# Altium schematic sheet infra&stlink.SchDoc
size Tabloid
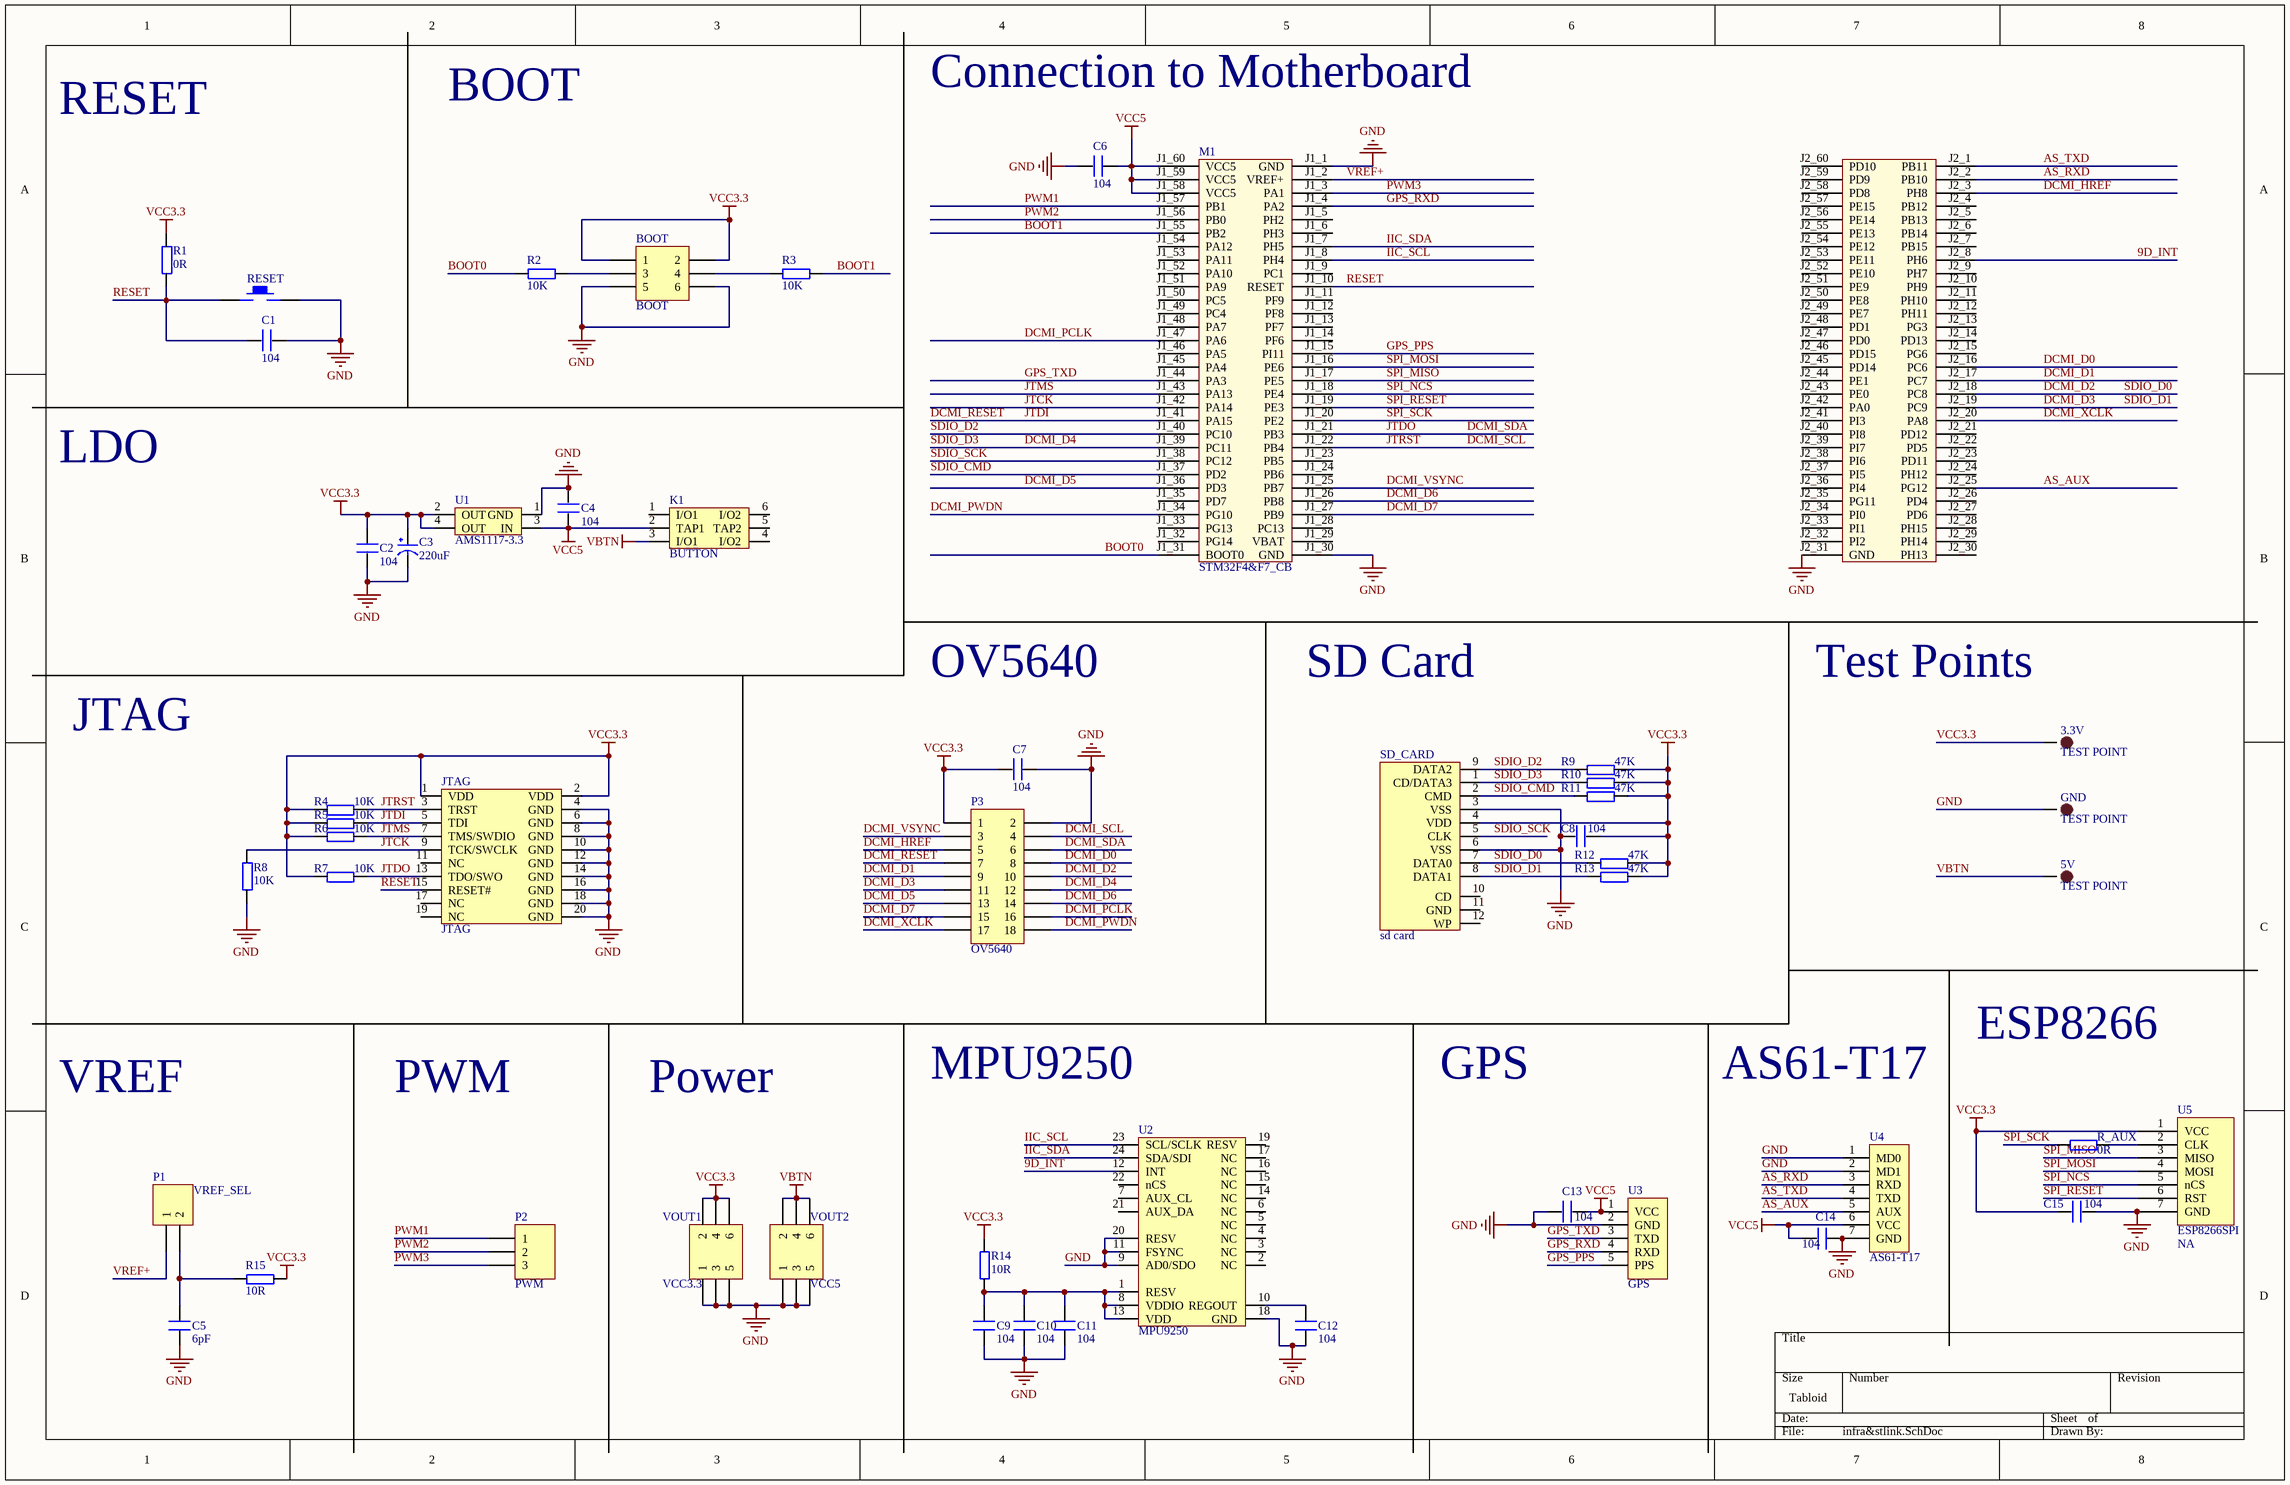
[diagram p0: infra&stlink.SchDoc]

## Parts
3.3V  TEST POINT  [TP-1.5]
5V  TEST POINT  [TP-1.5]
BOOT  BOOT  [HDR2X3]
C1  104  [0805]
C2  104  [0805]
C3  220uF  [CC6.56.5]
C4  104  [0805]
C5  6pF  [0805]
C6  104  [0805]
C7  104  [0805]
C8  104  [0805]
C9  104  [0805]
C10  104  [0805]
C11  104  [0805]
C12  104  [0805]
C13  104  [0805]
C14  104  [0805]
C15  104  [0805]
GND  TEST POINT  [TP-1.5]
JTAG  JTAG  [JTAG_20]
K1  BUTTON  [BTN8.5*8.5]
M1  STM32F4&F7_CB  [STM32F4&F7_CB]
P1  VREF_SEL  [HDR1X2]
P2  PWM  [HDR1X3]
P3  OV5640  [HDR2X9]
R1  0R  [0805]
R2  10K  [0805]
R3  10K  [0805]
R4  10K  [0805]
R5  10K  [0805]
R6  10K  [0805]
R7  10K  [0805]
R8  10K  [0805]
R9  47K  [0805]
R10  47K  [0805]
R11  47K  [0805]
R12  47K  [0805]
R13  47K  [0805]
R14  10R  [0805]
R15  10R  [0805]
R_AUX  0R  [0805]
RESET  KEY_M  [KEY_M]  (value not drawn)
SD_CARD  sd card  [SDCARD_L]
U1  AMS1117-3.3  [AMS1117]
U2  MPU9250  [QFN24-t]
U3  GPS  [HDR1X5]
U4  AS61-T17  [HDR1X7]
U5  NA  [Edge Connector7]
VOUT1  VCC3.3  [HDR2X3]
VOUT2  VCC5  [HDR2X3]

## Nets
GND: BOOT.5 BOOT.6 C1.2 C2.1 C3.2(GND) C4.2 C5.1 C6.1 C7.2 C8.1 C9.1 C10.1 C11.1 C12.1 C13.1 C14.1 C15.2 GND.1 JTAG.4(GND) JTAG.6(GND) JTAG.8(GND) JTAG.10(GND) JTAG.12(GND) JTAG.14(GND) JTAG.16(GND) JTAG.18(GND) JTAG.20(GND) M1.J1_1(GND) M1.J1_30(GND) M1.J2_31(GND) P3.2 R8.1 RESET.2 SD_CARD.3(VSS) SD_CARD.6(VSS) U1.1(GND) U2.9(AD0/SDO) U2.11(FSYNC) U2.18(GND) U2.20(RESV) U3.2(GND) U4.1(MD0) U4.2(MD1) U4.7(GND) U5.7(GND) VOUT1.1 VOUT1.3 VOUT1.5 VOUT2.1 VOUT2.3 VOUT2.5
VBTN: 5V.1 K1.3(I/O1) VOUT2.2 VOUT2.4 VOUT2.6
VCC3.3: 3.3V.1 BOOT.1 BOOT.2 C2.2 C3.1(VCC) C7.1 C8.2 C15.1 JTAG.1(VDD) JTAG.2(VDD) P3.1 R1.2 R4.1 R5.1 R6.1 R7.1 R9.2 R10.2 R11.2 R12.2 R13.2 R14.2 R15.2 SD_CARD.4(VDD) U1.2(OUT) U1.4(OUT) U5.1(VCC) VOUT1.2 VOUT1.4 VOUT1.6
VCC5: C4.1 C6.2 C13.2 C14.2 K1.2(TAP1) M1.J1_58(VCC5) M1.J1_59(VCC5) M1.J1_60(VCC5) U1.3(IN) U3.1(VCC) U4.6(VCC)
9D_INT: M1.J2_8(PH6) U2.12(INT)
AS_AUX: M1.J2_25(PG12) U4.5(AUX)
AS_RXD: M1.J2_2(PB10) U4.3(RXD)
AS_TXD: M1.J2_1(PB11) U4.4(TXD)
BOOT0: M1.J1_31(BOOT0) R2.1
BOOT1: M1.J1_55(PB2) R3.2
DCMI_D0: M1.J2_16(PC6) P3.8
DCMI_D1: M1.J2_17(PC7) P3.9
DCMI_D2: M1.J2_18(PC8) P3.10 R12.1 SD_CARD.7(DATA0)  [also labelled SDIO_D0]
DCMI_D3: M1.J2_19(PC9) P3.11 R13.1 SD_CARD.8(DATA1)  [also labelled SDIO_D1]
DCMI_D4: M1.J1_39(PC11) P3.12 R10.1 SD_CARD.1(CD/DATA3)  [also labelled SDIO_D3]
DCMI_D5: M1.J1_36(PD3) P3.13
DCMI_D6: M1.J1_26(PB8) P3.14
DCMI_D7: M1.J1_27(PB9) P3.15
DCMI_HREF: M1.J2_3(PH8) P3.5
DCMI_PCLK: M1.J1_47(PA6) P3.16
DCMI_PWDN: M1.J1_34(PG10) P3.18
DCMI_RESET: JTAG.5(TDI) M1.J1_41(PA15) P3.7 R5.2  [also labelled JTDI]
DCMI_SCL: JTAG.3(TRST) M1.J1_22(PB4) P3.4 R4.2  [also labelled JTRST]
DCMI_SDA: JTAG.13(TDO/SWO) M1.J1_21(PB3) P3.6 R7.2  [also labelled JTDO]
DCMI_VSYNC: M1.J1_25(PB7) P3.3
DCMI_XCLK: M1.J2_20(PA8) P3.17
GPS_PPS: M1.J1_15(PI11) U3.5(PPS)
GPS_RXD: M1.J1_4(PA2) U3.4(RXD)
GPS_TXD: M1.J1_44(PA3) U3.3(TXD)
IIC_SCL: M1.J1_8(PH4) U2.23(SCL/SCLK)
IIC_SDA: M1.J1_7(PH5) U2.24(SDA/SDI)
JTCK: JTAG.9(TCK/SWCLK) M1.J1_42(PA14) R8.2
JTMS: JTAG.7(TMS/SWDIO) M1.J1_43(PA13) R6.2
PWM1: M1.J1_57(PB1) P2.1
PWM2: M1.J1_56(PB0) P2.2
PWM3: M1.J1_3(PA1) P2.3
RESET: C1.1 JTAG.15(RESET#) M1.J1_10(RESET) R1.1 RESET.1
SDIO_CMD: M1.J1_37(PD2) R11.1 SD_CARD.2(CMD)
SDIO_D2: M1.J1_40(PC10) R9.1 SD_CARD.9(DATA2)
SDIO_SCK: M1.J1_38(PC12) SD_CARD.5(CLK)
SPI_MISO: M1.J1_17(PE5) U5.3(MISO)
SPI_MOSI: M1.J1_16(PE6) U5.4(MOSI)
SPI_NCS: M1.J1_18(PE4) U5.5(nCS)
SPI_RESET: M1.J1_19(PE3) U5.6(RST)
SPI_SCK: M1.J1_20(PE2) R_AUX.1
VREF+: M1.J1_2(VREF+) P1.1
NetBOOT_3: BOOT.3 R2.2
NetBOOT_4: BOOT.4 R3.1
NetC5_2: C5.2 P1.2 R15.1
NetC9_2: C9.2 C10.2 C11.2 R14.1 U2.1(RESV) U2.8(VDDIO) U2.13(VDD)
NetC12_2: C12.2 U2.10(REGOUT)
NetR_AUX_2: R_AUX.2 U5.2(CLK)

Not connected (* = marked no-connect by the designer): JTAG 11(NC) 17(NC) 19(NC); K1 1(I/O1) 4(I/O2) 5(TAP2) 6(I/O2); M1 J1_5(PH2) J1_6(PH3) J1_9(PC1) J1_11(PF9) J1_12(PF8) J1_13(PF7) J1_14(PF6) J1_23(PB5) J1_24(PB6) J1_28(PC13) J1_29(VBAT) J1_32(PG14) J1_33(PG13) J1_35(PD7) J1_45(PA4) J1_46(PA5) J1_48(PA7) J1_49(PC4) J1_50(PC5) J1_51(PA9) J1_52(PA10) J1_53(PA11) J1_54(PA12) J2_4(PB12) J2_5(PB13) J2_6(PB14) J2_7(PB15) J2_9(PH7) J2_10(PH9) J2_11(PH10) J2_12(PH11) J2_13(PG3) J2_14(PD13) J2_15(PG6) J2_21(PD12) J2_22(PD5) J2_23(PD11) J2_24(PH12) J2_26(PD4) J2_27(PD6) J2_28(PH15) J2_29(PH14) J2_30(PH13) J2_32(PI2) J2_33(PI1) J2_34(PI0) J2_35(PG11) J2_36(PI4) J2_37(PI5) J2_38(PI6) J2_39(PI7) J2_40(PI8) J2_41(PI3) J2_42(PA0) J2_43(PE0) J2_44(PE1) J2_45(PD14) J2_46(PD15) J2_47(PD0) J2_48(PD1) J2_49(PE7) J2_50(PE8) J2_51(PE9) J2_52(PE10) J2_53(PE11) J2_54(PE12) J2_55(PE13) J2_56(PE14) J2_57(PE15) J2_58(PD8) J2_59(PD9) J2_60(PD10); SD_CARD 10(CD) 11(GND) 12(WP); U2 2(NC) 3(NC) 4(NC) 5(NC) 6(NC) 7(AUX_CL) 14(NC) 15(NC) 16(NC) 17(NC) 19(RESV) 21(AUX_DA) 22(nCS)

## Notes on the sheet
- Connection to Motherboard
- RESET
- BOOT
- LDO
- OV5640
- SD Card
- Test Points
- JTAG
- VREF
- PWM
- Power
- MPU9250
- GPS
- AS61-T17
- ESP8266

## Library data of the parts
3.3V 5V GND = TEST-POINT: 测试点
BOOT VOUT1 VOUT2 = Header 3X2: Header, 3-Pin, Dual row; LatestRevisionDate: 17-Jul-2002; LatestRevisionNote: Re-released for DXP Platform.; Publisher: Altium Limited
C1 C2 C4-C15 = C
C3 = CAP
M1 = STM32F4&F7_CB: F429/746 Core Board
P1 = Header 2: Header, 2-Pin; LatestRevisionDate: 17-Jul-2002; LatestRevisionNote: Re-released for DXP Platform.; Publisher: Altium Limited
P2 = Header 3: Header, 3-Pin; LatestRevisionDate: 17-Jul-2002; LatestRevisionNote: Re-released for DXP Platform.; Publisher: Altium Limited
P3 = Header 9X2: Header, 9-Pin, Dual row; LatestRevisionDate: 17-Jul-2002; LatestRevisionNote: Re-released for DXP Platform.; Publisher: Altium Limited
R1-R15 R_AUX = R
U1 = AMS1117
U2 = MPU9250: 9轴运动处理传感器
U3 = Header 5: Header, 5-Pin; LatestRevisionDate: 17-Jul-2002; LatestRevisionNote: Re-released for DXP Platform.; Publisher: Altium Limited
U4 = Header 7: Header, 7-Pin; LatestRevisionDate: 17-Jul-2002; LatestRevisionNote: Re-released for DXP Platform.; Publisher: Altium Limited
U5 = ESP8266SPI